# Altium schematic sheet OTGW01_psu_rev1.SchDoc
size A4; SheetNumber: 4
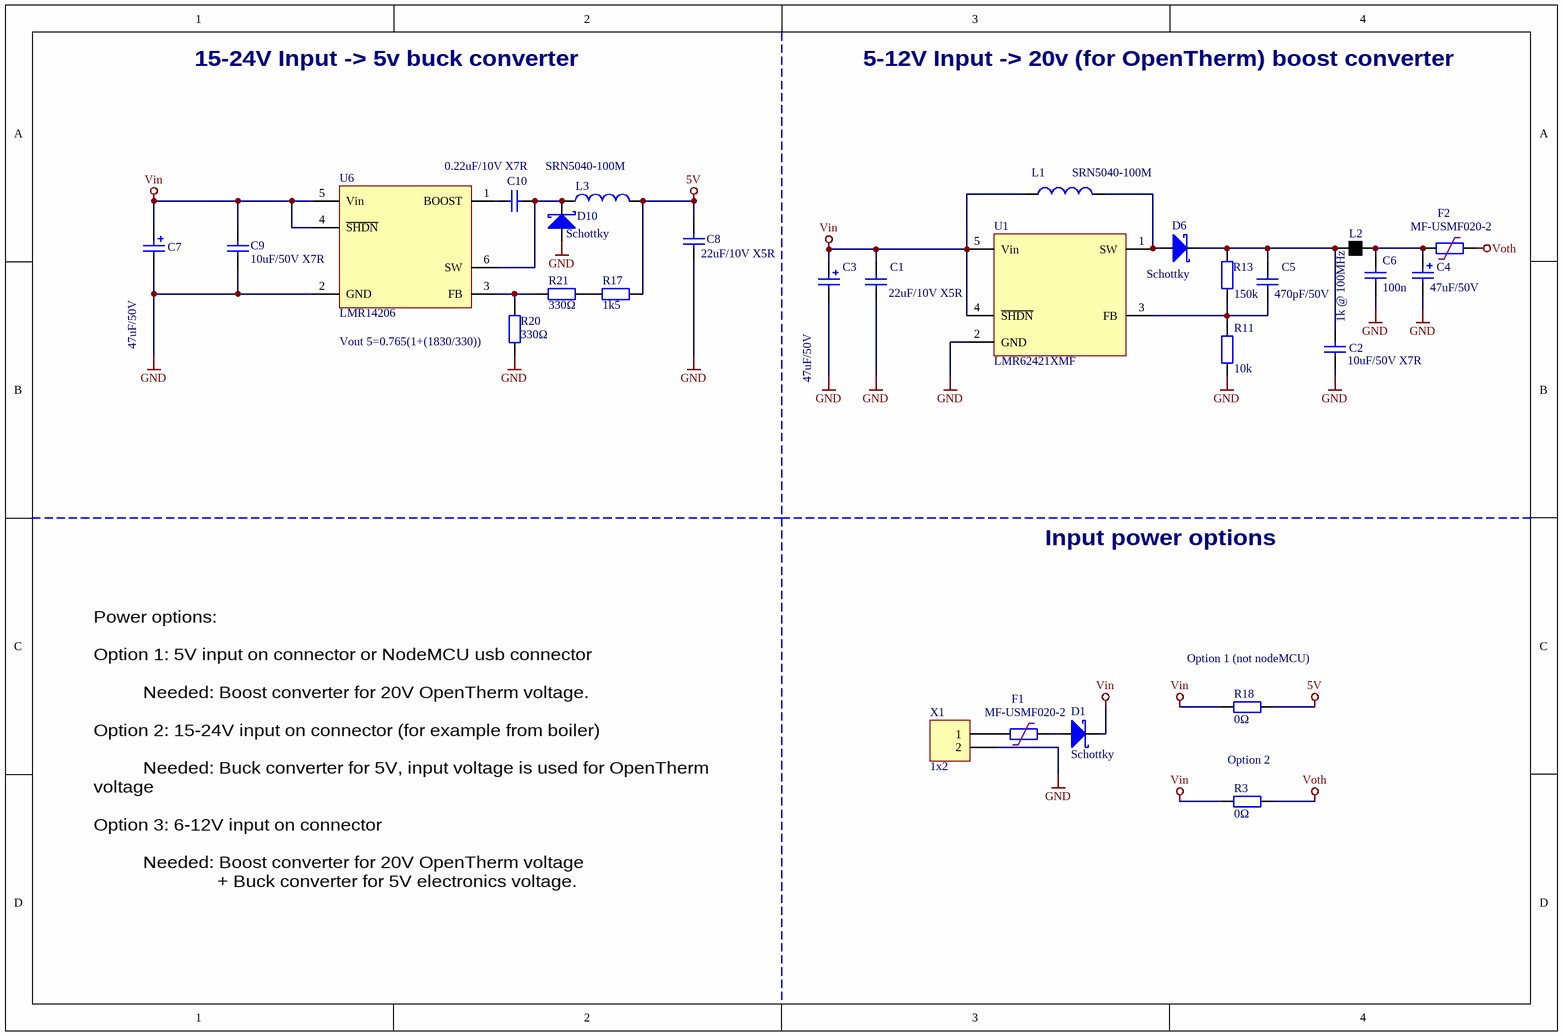
[diagram p0: OTGW01_psu_rev1.SchDoc]

## Parts
C1  22uF/10V X5R  [1210]
C2  10uF/50V X7R  [1210]
C3  47uF/50V  [C_D8]
C4  47uF/50V  [C_D8]
C5  470pF/50V  [0805]
C6  100n  [0805]
C7  47uF/50V  [C_D8]
C8  22uF/10V X5R  [1210]
C9  10uF/50V X7R  [1210]
C10  0.22uF/10V X7R  [0805]
D1  Schottky  [SOD123]
D6  Schottky  [SOD123]
D10  Schottky  [SOD123]
F1  MF-USMF020-2  [1210F]
F2  MF-USMF020-2  [1210F]
L1  SRN5040-100M  [SRN5040]
L2  1k @ 100MHz  [0805]
L3  SRN5040-100M  [SRN5040]
R3  0Ω  [0805]
R11  10k  [0805]
R13  150k  [0805]
R17  1k5  [0805]
R18  0Ω  [0805]
R20  330Ω  [0805]
R21  330Ω  [0805]
U1  LMR62421XMF  [SOT23_5]
U6  LMR14206  [SOT23_6]
X1  1x2  [Terminal_2x3.5mm]

## Nets
5V: C8.2 L3.2 R17.2 R18.2
GND: C1.1 C2.2 C3.2 C4.2 C6.1 C7.2 C8.1 C9.1 D10.2 R11.2 R20.1 U1.2(GND) U6.2(GND) X1.2
Vin: C1.2 C3.1 C7.1 C9.2 D1.1 L1.1 R3.1 R18.1 U1.4(~{SHDN}) U1.5(Vin) U6.4(~{SHDN}) U6.5(Vin)
Voth: F2.2 R3.2
NetC2_1: C2.1 C5.1 D6.1 L2.2(OUT) R13.1
NetC4_1: C4.1 C6.2 F2.1 L2.1(IN)
NetC5_2: C5.2 R11.1 R13.2 U1.3(FB)
NetC10_1: C10.1 D10.1 L3.1 U6.6(SW)
NetC10_2: C10.2 U6.1(BOOST)
NetD1_2: D1.2 F1.2
NetD6_2: D6.2 L1.2 U1.1(SW)
NetF1_1: F1.1 X1.1
NetR17_1: R17.1 R21.2
NetR20_2: R20.2 R21.1 U6.3(FB)

## Notes on the sheet
- 15-24V Input -> 5v buck converter
- 5-12V Input -> 20v (for OpenTherm) boost converter
- (near R20) Vout 5=0.765(1+(1830/330))
- Input power options
- (near R18) Option 1 (not nodeMCU)
- Option 2
- Power options:
  Option 1: 5V input on connector or NodeMCU usb connector
  Needed: Boost converter for 20V OpenTherm voltage.
  Option 2: 15-24V input on connector (for example from boiler)
  Needed: Buck converter for 5V, input voltage is used for OpenTherm voltage
  Option 3: 6-12V input on connector
  Needed: Boost converter for 20V OpenTherm voltage
  + Buck converter for 5V electronics voltage.

## Library data of the parts
C1 C2 C5 C6 C8-C10 = C: Capacitor Non Polarized; Supplier 1: Farnell
  C1 C8: Supplier Part Number 1: 2497183
  C2 C9: Supplier Part Number 1: 2362133
  C5: Supplier Part Number 1: 1520294
  C6: Supplier Part Number 1: 2470437
  C10: Supplier Part Number 1: 2409051
C3 C4 C7 = C_POL: Capacitor Polarized; Supplier 1: Farnell; Supplier Part Number 1: 1850121
D1 D6 D10 = D_S: Supplier 1: Farnell; Supplier Part Number 1: 2284963
F1 F2 = PPTC: Supplier 1: Farnell; Supplier Part Number 1: 1294883
L1 L3 = L: Supplier 1: Farnell; Supplier Part Number 1: 2428234
L2 = Ferrite: Supplier 1: Farnell; Supplier Part Number 1: 1635737
R3 R11 R13 R17 R18 R20 R21 = R: Resistor; Supplier 1: Farnell
  R3 R18: Supplier Part Number 1: 9233750
  R11: Supplier Part Number 1: 9332391
  R13: Supplier Part Number 1: 9332626
  R17: Supplier Part Number 1: 9332600
  R20 R21: Supplier Part Number 1: 9333037
X1 = CON_1x2: Supplier 1: Farnell; Supplier Part Number 1: 1098611
U1 = LMR62421XMF: Supplier 1: Farnell; Supplier Part Number 1: 2064678
U6 = LMR14206: Supplier 1: Farnell; Supplier Part Number 1: 2323514